# Altium project fastic_readout.PrjPcb (part 1 of 3)
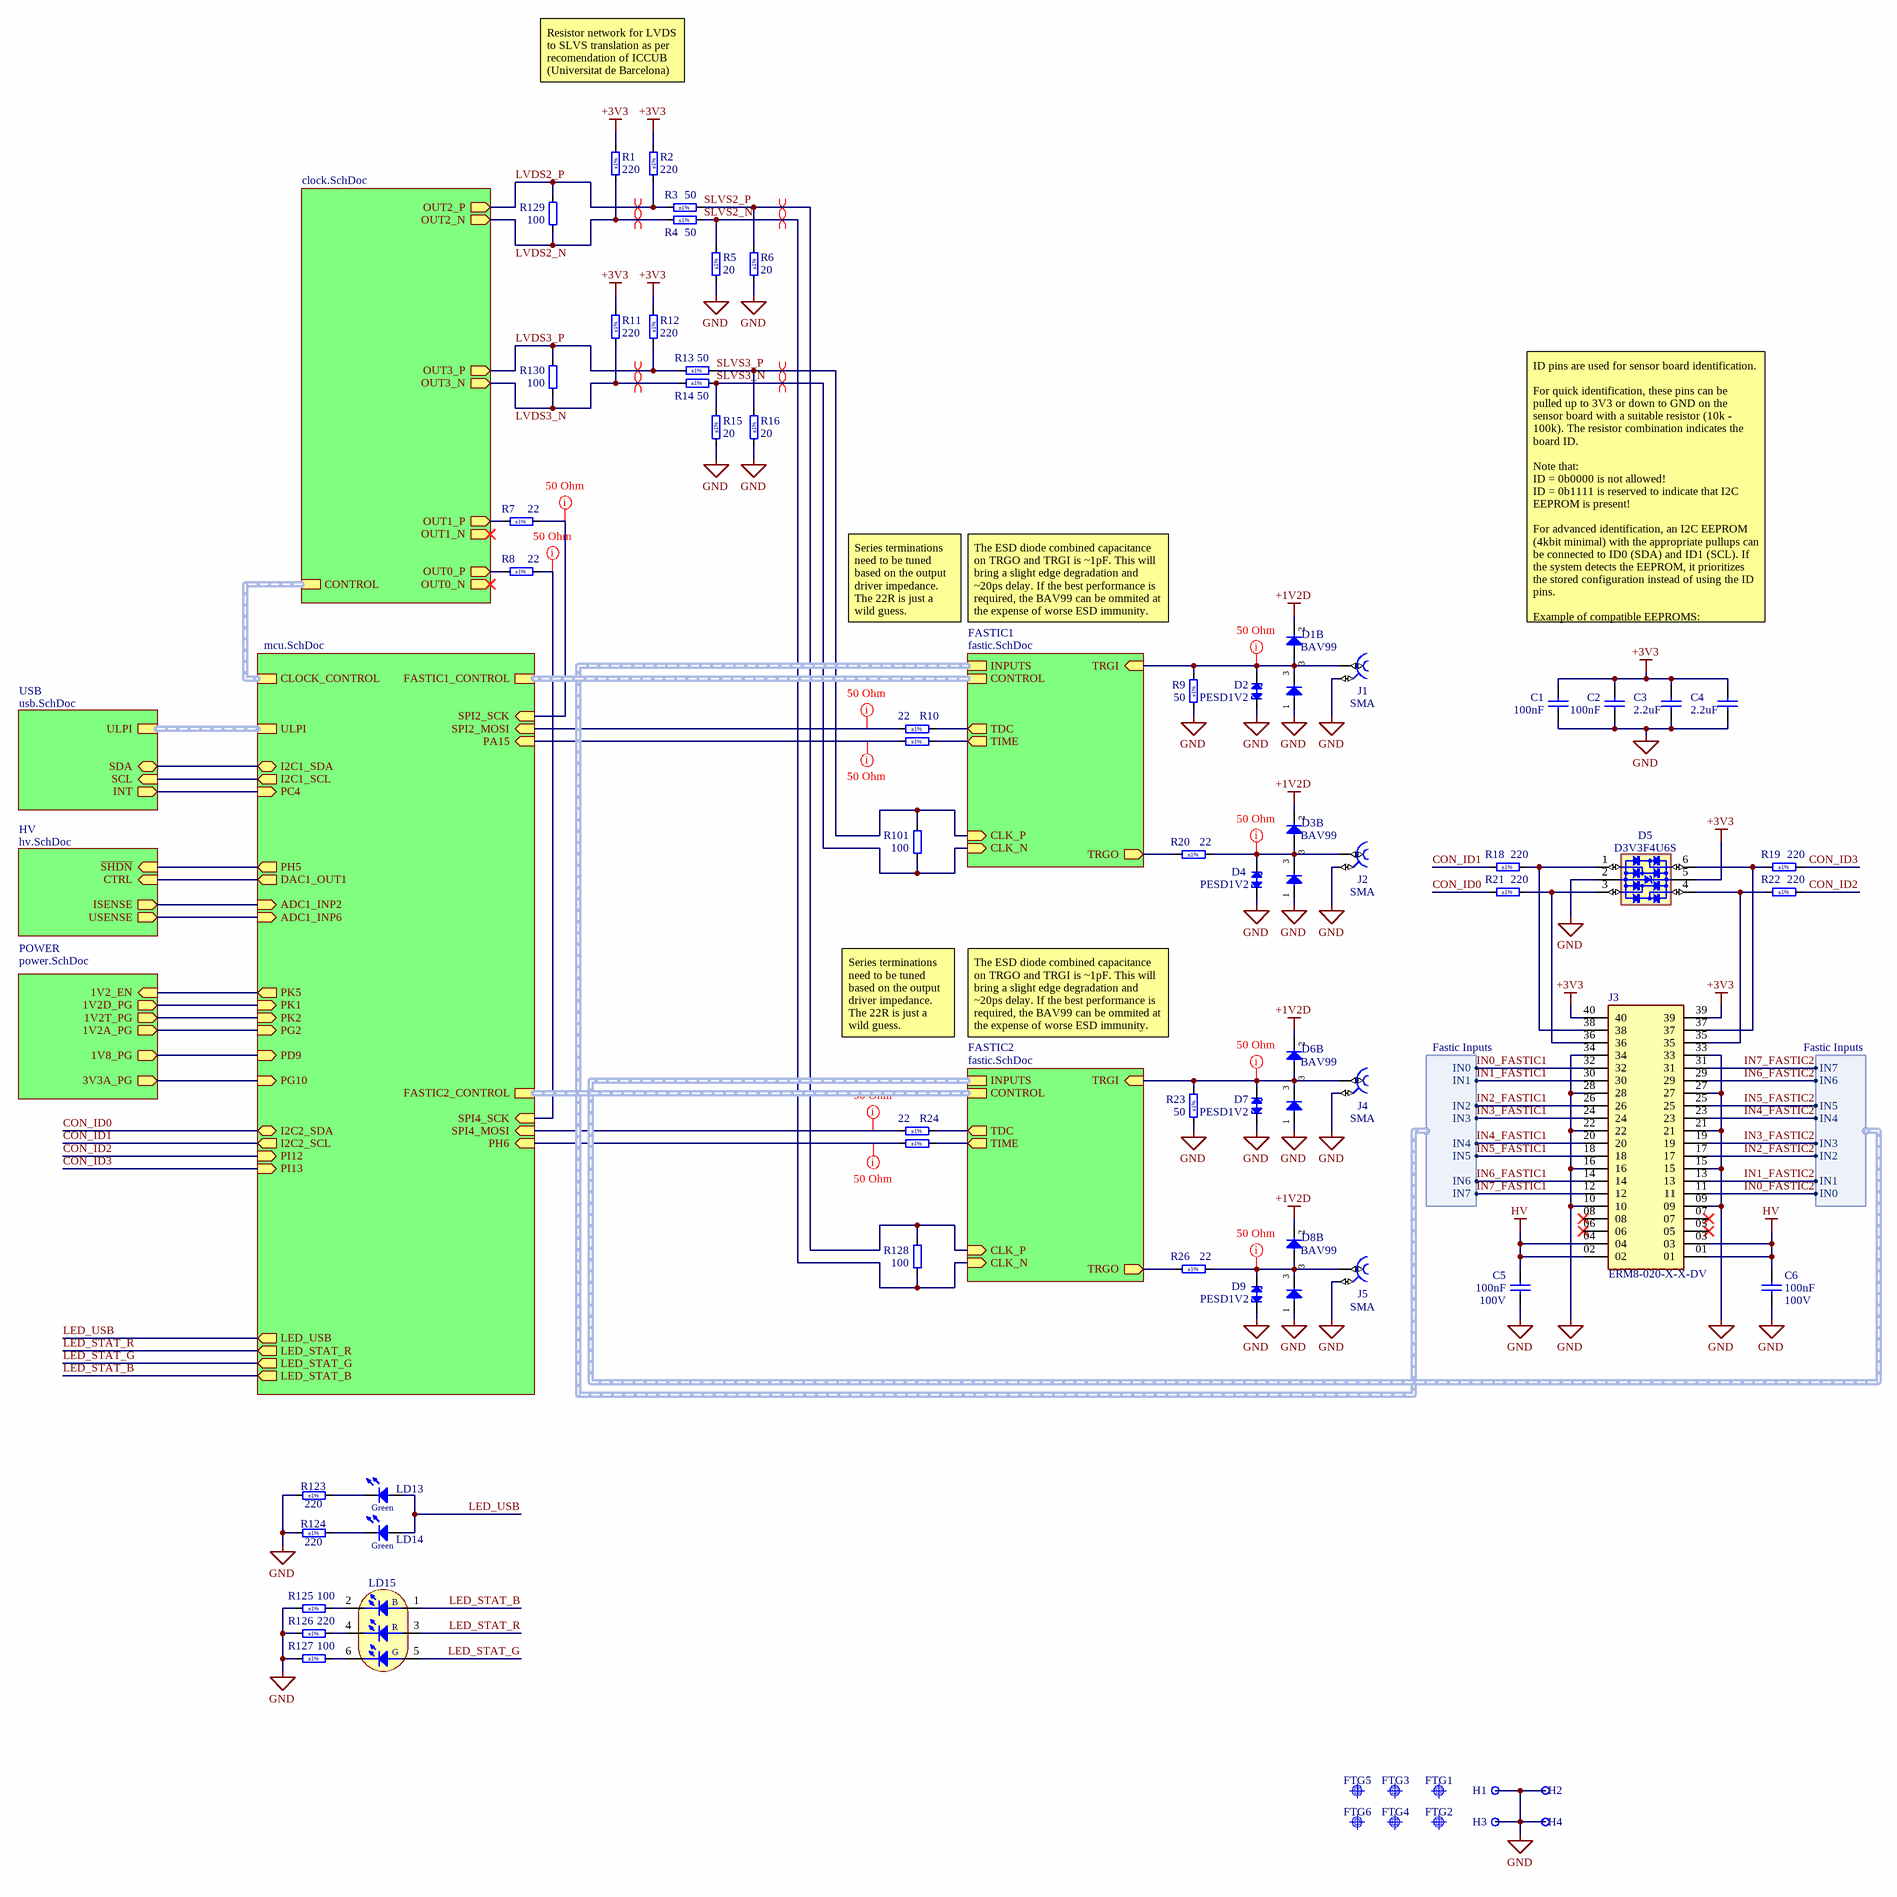
[diagram p0: top.SchDoc]
CheckedBy: Jerome A. Alozy; Designer: Vojtech Vosahlo; DivGrp: EP- ESE; DrawnBy: Vojtech Vosahlo; Projet: FastIC+ readout; revision: 1.0
7 sheets, 356 parts. Net scope: hierarchical (ports join the sheet entries above them; power ports are global).
Board file: fastic_readout.PcbDoc
Sheets:
  top.SchDoc
    FASTIC1 = fastic.SchDoc
    HV = hv.SchDoc
     = clock.SchDoc
    POWER = power.SchDoc
     = mcu.SchDoc
    USB = usb.SchDoc
    FASTIC2 = fastic.SchDoc

## Sheet top.SchDoc: FastIC+ readout
size 594 x 420 mm; CheckedBy: Jerome A. Alozy; CompanyName: CERN; DrawnBy: Vojtech Vosahlo; Organization: CERN; Address1: European Organization for Nuclear Research; Address2: CH-1211 Genève 23 - Switzerland; Revision: 2.0; SheetNumber: 1; SheetTotal: 7; Projet: Fast Timing; CreateDate: 11/1/2024; DivGrp: EP-ESE; Designer: Vojtech Vosahlo; ModifiedDate: -

### Parts
(Parts that share a designator on the sheet are numbered #1, #2 ... from top to bottom, then left to right.)
C1  100nF  [CAPC1005X55N]
C2  100nF  [CAPC1005X55N]
C3  2.2uF  [CAPC1608X90N]
C4  2.2uF  [CAPC1608X90N]
C5  100nF  Voltage: 100V  [CAPC1608X90N]
C6  100nF  Voltage: 100V  [CAPC1608X90N]
D1  BAV99  [SOT95P240X110-3N]  (value not drawn)  (parts A,B of 2)
D2  PESD1V2  [SOD962-2]
D3  BAV99  [SOT95P240X110-3N]  (value not drawn)  (parts A,B of 2)
D4  PESD1V2  [SOD962-2]
D5  D3V3F4U6S  [SOT65P220X110-6N]
D6  BAV99  [SOT95P240X110-3N]  (value not drawn)  (parts A,B of 2)
D7  PESD1V2  [SOD962-2]
D8  BAV99  [SOT95P240X110-3N]  (value not drawn)  (parts A,B of 2)
D9  PESD1V2  [SOD962-2]
FTG1  Use only in PCB  [FIDUCIAL_TOP_C100-200]  (value not drawn)
FTG2  Use only in PCB  [FIDUCIAL_TOP_C100-200]  (value not drawn)
FTG3  Use only in PCB  [FIDUCIAL_TOP_C100-200]  (value not drawn)
FTG4  Use only in PCB  [FIDUCIAL_TOP_C100-200]  (value not drawn)
FTG5  Use only in PCB  [FIDUCIAL_TOP_C100-200]  (value not drawn)
FTG6  Use only in PCB  [FIDUCIAL_TOP_C100-200]  (value not drawn)
H1  Plated Hole  [MTG240_400]  (value not drawn)  (no BOM)
H2  Plated Hole  [MTG240_400]  (value not drawn)  (no BOM)
H3  Plated Hole  [MTG240_400]  (value not drawn)  (no BOM)
H4  Plated Hole  [MTG240_400]  (value not drawn)  (no BOM)
J1  SMA  [AMPHENOL_132203]
J2  SMA  [AMPHENOL_132203]
J3  ERM8-020-X-X-DV  [SAMTEC_ERM8-020-X-X-DV]
J4  SMA  [AMPHENOL_132203]
J5  SMA  [AMPHENOL_132203]
LD13  Green  [LED_KINGBRIGHT_KPH-1608CGCK]
LD14  Green  [LED_KINGBRIGHT_KPH-1608CGCK]
LD15  Red/Green/Blue  [LED_EVERLIGHT_EAST1616RGBA8]  (value not drawn)
R1  220  Tolerance: ±1%  [RESC1005X40N]
R2  220  Tolerance: ±1%  [RESC1005X40N]
R3  50  Tolerance: ±1%  [RESC1005X40N]
R4  50  Tolerance: ±1%  [RESC1005X40N]
R5#1  20  Tolerance: ±1%  [RESC1005X40N]
R6  20  Tolerance: ±1%  [RESC1005X40N]
R7  22  Tolerance: ±1%  [RESC1005X40N]
R8  22  Tolerance: ±1%  [RESC1005X40N]
R9#1  50  Tolerance: ±1%  [RESC1005X40N]
R10  22  Tolerance: ±1%  [RESC1005X40N]
R11  220  Tolerance: ±1%  [RESC1005X40N]
R12  220  Tolerance: ±1%  [RESC1005X40N]
R13  50  Tolerance: ±1%  [RESC1005X40N]
R14  50  Tolerance: ±1%  [RESC1005X40N]
R15  20  Tolerance: ±1%  [RESC1005X40N]
R16  20  Tolerance: ±1%  [RESC1005X40N]
R17  Tolerance: ±1%  [RESC1005X40N]  (hidden comment: 22)
R18  220  Tolerance: ±1%  [RESC1005X40N]
R19  220  Tolerance: ±1%  [RESC1005X40N]
R20  22  Tolerance: ±1%  [RESC1005X40N]
R21  220  Tolerance: ±1%  [RESC1005X40N]
R22  220  Tolerance: ±1%  [RESC1005X40N]
R23  50  Tolerance: ±1%  [RESC1005X40N]
R24  22  Tolerance: ±1%  [RESC1005X40N]
R25  Tolerance: ±1%  [RESC1005X40N]  (hidden comment: 22)
R26  22  Tolerance: ±1%  [RESC1005X40N]
R101  100  [RESC1005X40N]
R123  220  Tolerance: ±1%  [RESC1005X40N]
R124  220  Tolerance: ±1%  [RESC1005X40N]
R125  100  Tolerance: ±1%  [RESC1005X40N]
R126  220  Tolerance: ±1%  [RESC1005X40N]
R127  100  Tolerance: ±1%  [RESC1005X40N]
R128  100  [RESC1005X40N]
R129  100  [RESC1005X40N]
R130  100  [RESC1005X40N]

### Sub-sheets
FASTIC1 = fastic.SchDoc: TRGI (in), TRGO (out), INPUTS (harness Fastic Inputs), CLK_P (in), CLK_N (in), TDC (out), TIME (out), CONTROL (harness Fastic Control)
FASTIC2 = fastic.SchDoc: TRGI (in), TRGO (out), INPUTS (harness Fastic Inputs), CLK_P (in), CLK_N (in), TDC (out), TIME (out), CONTROL (harness Fastic Control)
HV = hv.SchDoc: ISENSE (out), USENSE (out), ~{SHDN} (in), CTRL (in)
POWER = power.SchDoc: 1V8_PG (out), 3V3A_PG (out), 1V2A_PG (out), 1V2T_PG (out), 1V2D_PG (out), 1V2_EN (in)
USB = usb.SchDoc: ULPI (harness ULPI), SCL (in), SDA (bidir), INT (out)
? = clock.SchDoc: OUT0_P (out), OUT0_N (out), OUT1_P (out), OUT1_N (out), OUT2_P (out), OUT2_N (out), OUT3_P (out), OUT3_N (out), CONTROL (harness Clock Control)
? = mcu.SchDoc: ULPI (harness ULPI), CLOCK_CONTROL (harness Clock Control), FASTIC1_CONTROL (harness Fastic Control), FASTIC2_CONTROL (harness Fastic Control), DAC1_OUT1 (out), ADC1_INP2 (in), ADC1_INP6 (in), I2C2_SDA (bidir), I2C2_SCL (out), SPI2_MOSI (in), SPI4_SCK (in), SPI2_SCK (in), PH6 (in), PA15 (in), I2C1_SDA (bidir), I2C1_SCL (out), PI12 (in), PI13 (in), LED_USB (out), LED_STAT_R (out), LED_STAT_G (out), LED_STAT_B (out), SPI4_MOSI (in), PH5 (out), PK1 (in), PK2 (in), PG2 (in), PD9 (in), PG10 (in), PK5 (out), PC4 (in)

### Harnesses
Fastic Inputs: IN0, IN1, IN2, IN3, IN4, IN5, IN6, IN7

### Nets
+1V2D: D1.2(C) D3.2(C) D6.2(C) D8.2(C)
+3V3: C1.2 C2.2 C3.1 C4.1 D5.5(VBUS) J3.39 J3.40 R1.2 R2.2 R11.2 R12.2
GND: C1.1 C2.1 C3.2 C4.2 C5.1 C6.1 D1.1(A) D2.1(C) D3.1(A) D4.1(C) D5.2(GND) D6.1(A) D7.1(C) D8.1(A) D9.1(C) H1.1 H2.1 H3.1 H4.1 J1.2 J2.2 J3.09 J3.10 J3.15 J3.16 J3.21 J3.22 J3.27 J3.28 J3.33 J3.34 J4.2 J5.2 R5#1.1 R6.1 R9#1.1 R15.1 R16.1 R23.1 R123.1 R124.1 R125.1 R126.1 R127.1
HV: C5.2 C6.2 J3.01 J3.02 J3.03 J3.04
CON_ID0: R21.1 ; sheet /I2C2_SDA
CON_ID1: R18.1 ; sheet /I2C2_SCL
CON_ID2: R22.2 ; sheet /PI12
CON_ID3: R19.2 ; sheet /PI13
IN0_FASTIC1: J3.32 ; sheet FASTIC1/INPUTS.IN0  [project net IN0]
IN0_FASTIC2: J3.11 ; sheet FASTIC2/INPUTS.IN0  [project net IN0]
IN1_FASTIC1: J3.30 ; sheet FASTIC1/INPUTS.IN1  [project net IN1]
IN1_FASTIC2: J3.13 ; sheet FASTIC2/INPUTS.IN1  [project net IN1]
IN2_FASTIC1: J3.26 ; sheet FASTIC1/INPUTS.IN2  [project net IN2]
IN2_FASTIC2: J3.17 ; sheet FASTIC2/INPUTS.IN2  [project net IN2]
IN3_FASTIC1: J3.24 ; sheet FASTIC1/INPUTS.IN3  [project net IN3]
IN3_FASTIC2: J3.19 ; sheet FASTIC2/INPUTS.IN3  [project net IN3]
IN4_FASTIC1: J3.20 ; sheet FASTIC1/INPUTS.IN4  [project net IN4]
IN4_FASTIC2: J3.23 ; sheet FASTIC2/INPUTS.IN4  [project net IN4]
IN5_FASTIC1: J3.18 ; sheet FASTIC1/INPUTS.IN5  [project net IN5]
IN5_FASTIC2: J3.25 ; sheet FASTIC2/INPUTS.IN5  [project net IN5]
IN6_FASTIC1: J3.14 ; sheet FASTIC1/INPUTS.IN6  [project net IN6]
IN6_FASTIC2: J3.29 ; sheet FASTIC2/INPUTS.IN6  [project net IN6]
IN7_FASTIC1: J3.12 ; sheet FASTIC1/INPUTS.IN7  [project net IN7]
IN7_FASTIC2: J3.31 ; sheet FASTIC2/INPUTS.IN7  [project net IN7]
LED_STAT_B: LD15.1(AB) ; sheet /LED_STAT_B
LED_STAT_G: LD15.5(AG) ; sheet /LED_STAT_G
LED_STAT_R: LD15.3(AR) ; sheet /LED_STAT_R
LED_USB: LD13.2(A) LD14.2(A) ; sheet /LED_USB
LVDS2_N: R1.1 R4.1 R129.2 ; sheet /OUT2_N
LVDS2_P: R2.1 R3.1 R129.1 ; sheet /OUT2_P
LVDS3_N: R11.1 R14.1 R130.2 ; sheet /OUT3_N
LVDS3_P: R12.1 R13.1 R130.1 ; sheet /OUT3_P
SLVS2_N: R4.2 R5#1.2 R128.2 ; sheet FASTIC2/CLK_N
SLVS2_P: R3.2 R6.2 R128.1 ; sheet FASTIC2/CLK_P
SLVS3_N: R14.2 R15.2 R101.2 ; sheet FASTIC1/CLK_N
SLVS3_P: R13.2 R16.2 R101.1 ; sheet FASTIC1/CLK_P
NetD1_3: D1.3(COMAC) D2.2(C) J1.1 R9#1.2 ; sheet FASTIC1/TRGI
NetD3_3: D3.3(COMAC) D4.2(C) J2.1 R20.2
NetD5_1: D5.1(I/O1) J3.38 R18.2
NetD5_3: D5.3(I/O2) J3.36 R21.2
NetD5_4: D5.4(I/O3) J3.35 R22.1
NetD5_6: D5.6(I/O4) J3.37 R19.1
NetD6_3: D6.3(COMAC) D7.2(C) J4.1 R23.2 ; sheet FASTIC2/TRGI
NetD8_3: D8.3(COMAC) D9.2(C) J5.1 R26.2
NetIC1_FASTIC1_6: R17.1 ; sheet FASTIC1/TIME
NetIC1_FASTIC1_7: R10.1 ; sheet FASTIC1/TDC
NetIC1_FASTIC2_6: R25.1 ; sheet FASTIC2/TIME
NetIC1_FASTIC2_7: R24.1 ; sheet FASTIC2/TDC
NetIC4_5: sheet POWER/1V8_PG, sheet /PD9
NetIC5_5: sheet POWER/3V3A_PG, sheet /PG10
NetIC6_4: sheet POWER/1V2_EN, sheet /PK5
NetIC6_5: sheet POWER/1V2D_PG, sheet /PK1
NetIC7_5: sheet POWER/1V2T_PG, sheet /PK2
NetIC8_5: sheet POWER/1V2A_PG, sheet /PG2
NetIC14_5: sheet /PC4, sheet USB/INT
NetIC14_6: sheet /I2C1_SCL, sheet USB/SCL
NetIC14_7: sheet /I2C1_SDA, sheet USB/SDA
NetIC18_FASTIC1_35: R20.1 ; sheet FASTIC1/TRGO
NetIC18_FASTIC2_35: R26.1 ; sheet FASTIC2/TRGO
NetIC29_1: sheet HV/ISENSE, sheet /ADC1_INP2
NetIC30_1: sheet HV/USENSE, sheet /ADC1_INP6
NetLD13_1: LD13.1(C) R123.2
NetLD14_1: LD14.1(C) R124.2
NetLD15_2: LD15.2(CB) R125.2
NetLD15_4: LD15.4(CR) R126.2
NetLD15_6: LD15.6(CG) R127.2
NetR7_1: R7.1 ; sheet /OUT1_P
NetR7_2: R7.2 ; sheet /SPI2_SCK
NetR8_1: R8.1 ; sheet /OUT0_P
NetR8_2: R8.2 ; sheet /SPI4_SCK
NetR10_2: R10.2 ; sheet /SPI2_MOSI
NetR17_2: R17.2 ; sheet /PA15
NetR24_2: R24.2 ; sheet /SPI4_MOSI
NetR25_2: R25.2 ; sheet /PH6
NetU1_28: sheet HV/CTRL, sheet /DAC1_OUT1
(unnamed): sheet HV/~{SHDN}, sheet /PH5

Not connected (* = marked no-connect by the designer): J3 05* 06* 07* 08*

### Buses and harness runs
harness sheet /CLOCK_CONTROL = sheet /CONTROL
harness sheet /FASTIC1_CONTROL = sheet FASTIC1/CONTROL
harness sheet /FASTIC2_CONTROL = sheet FASTIC2/CONTROL
harness sheet /ULPI = sheet USB/ULPI

### Layout directives
differential pair: LVDS2_N, LVDS2_P, LVDS3_N, LVDS3_P, SLVS2_N, SLVS2_P, SLVS3_N, SLVS3_P
net class 50Ohm: NetD1_3, NetD3_3, NetD6_3, NetD8_3, NetR7_2, NetR8_2, NetR10_2, NetR17_2, NetR24_2, NetR25_2

### Notes on the sheet
- Resistor network for LVDS to SLVS translation as per recomendation of ICCUB (Universitat de Barcelona)
- Series terminations need to be tuned based on the output driver impedance. The 22R is just a wild guess.
- The ESD diode combined capacitance on TRGO and TRGI is ~1pF. This will bring a slight edge degradation and ~20ps delay. If the best performance is required, the BAV99 can be ommited at the expense of worse ESD immunity.
- ID pins are used for sensor board identification.
  For quick identification, these pins can be pulled up to 3V3 or down to GND on the sensor board with a suitable resistor (10k - 100k). The resistor combination indicates the board ID.
  Note that:
  ID = 0b0000 is not allowed!
  ID = 0b1111 is reserved to indicate that I2C EEPROM is present!
  For advanced identification, an I2C EEPROM (4kbit minimal) with the appropriate pullups can be connected to ID0 (SDA) and ID1 (SCL). If the system detects the EEPROM, it prioritizes the stored configuration instead of using the ID pins.
  Example of compatible EEPROMS:
  • Microchip 24AA series (eg. 24AA04T-I/OT)
- Project/Equipment
- Document
- File
- Designer
- Drawn by
- Check.by
- Last Mod.
- Print Date
- Sheet
- Size
- A2
- of
- Rev
- (in symbol LED_EVERLIGHT_EAST1616RGBA8) B; R; G

### Library data of the parts
C1 C2 = CC0402_100NF_16V_10%_X7R: Non-polarised capacitor; Part Description: SMD Multilayer Chip Ceramic Capacitor; Manufacturer: GENERIC; Manufacturer1 Part Number: GRM155R71C104KA88D; Voltage: 16V; TC: X7R; Tolerance: ±10%; Part Number: CC0402_100NF_16V_10%_X7R; Component Kind: Standard; Component Type: Standard; Pin Count: 2; Value: 100nF; Status: Not Recommended; Manufacturer Part Number: CC0402_100NF_16V_10%_X7R; Case: 0402; Mounted: Yes; Socket: No; SMD: Yes; Sense: No; Manufacturer1 Example: MURATA; Manufacturer1 ComponentHeight: 0.55mm; HelpURL: \\cern.ch\dfs\Applications\Altium\Datasheets\CC0402_X7R_MURATA_GRM.pdf; Author: CERN DEM JLC; CreateDate: 12/5/2013; LatestRevisionDate: 12/3/2007
C3 C4 = CC0603_2.2UF_10V_20%_X7R: Non-polarised capacitor; Part Description: SMD Multilayer Chip Ceramic Capacitor; Manufacturer: GENERIC; Manufacturer1 Part Number: LMK107B7225MA-T; Voltage: 10V; TC: X7R; Tolerance: ±20%; Part Number: CC0603_2.2UF_10V_20%_X7R; Component Kind: Standard; Component Type: Standard; Pin Count: 2; Value: 2.2uF; Status: Not Recommended; Manufacturer Part Number: CC0603_2.2UF_10V_20%_X7R; Case: 0603; Mounted: Yes; Socket: No; SMD: Yes; Sense: No; Manufacturer1 Example: TAIYO YUDEN; Manufacturer1 ComponentHeight: 0.9mm; HelpURL: \\cern.ch\dfs\Applications\Altium\Datasheets\CC0603_X7R_TAIYO-YUDEN_HIGH-VALUE.pdf; Author: CERN DEM JLC; CreateDate: 6/22/2011; LatestRevisionDate: 6/27/2011
C5 C6 = CC0603_100NF_100V_10%_X7R: Non-polarised capacitor; Part Description: SMD Multilayer Chip Ceramic Capacitor; Manufacturer: GENERIC; Manufacturer1 Part Number: GRM188R72A104KA35D; TC: X7R; Tolerance: ±10%; Part Number: CC0603_100NF_100V_10%_X7R; Component Kind: Standard; Component Type: Standard; Pin Count: 2; Value: 100nF; Status: None; Manufacturer Part Number: CC0603_100NF_100V_10%_X7R; Case: 0603; Mounted: Yes; Socket: No; SMD: Yes; Sense: No; Manufacturer1 Example: MURATA; Manufacturer1 ComponentHeight: 0.9mm; HelpURL: \\cern.ch\dfs\Applications\Altium\Datasheets\CC0603_MURATA_GRM188R72A104KA35D.pdf; Author: CERN DEM JLC; CreateDate: 12/11/2013; LatestRevisionDate: 12/11/2013
D1 D3 D6 D8 = BAV99: Serial Diode; Part Description: Dual Series Signal Diode; Manufacturer: FAIRCHILD SEMICONDUCTOR; Voltage: 70V; Power: 350mW; PressFit: No; Bonding: No; Part Number: BAV99; Component Kind: Standard; Component Type: Standard; Device: BAV99; PackageDescription: SOT, 0.95mm Pitch; 3 Pin, 1.40mm W X 3.00mm L X 1.10mm H body, IPC Medium Density; Manufacturer Part Number: BAV99; Pin Count: 3; Case: SOT23-3; Mounted: Yes; Socket: No; SMD: Yes; Sense: No; ComponentHeight: 1.1mm; HelpURL: \\cern.ch\dfs\Applications\Altium\Datasheets\BAV99.pdf; Author: CERN DEM JLC; CreateDate: 5/6/2008; LatestRevisionDate: 9/27/2012
D2 D4 D7 D9 = PESD1V2Y1BSF
D5 = D3V3F4U6S: Integrated Quad Ultra-Low Capacitance ESD Protection; Part Description: 0.85pF 4 Channel Low Capacitance TVS Diode Array ESD; Manufacturer: DIODES INCORPORATED; PressFit: No; Bonding: No; Voltage: 8kV; Part Number: D3V3F4U6S; Component Kind: Standard; Component Type: Standard; Device: D3V3F4U6S; PackageDescription: SOT363, SC70-6, 0.65mm Pitch; 6 pin, 1.25mm W X 2.00mm L X 1.10mm H body, IPC Medium Density; Manufacturer Part Number: D3V3F4U6S; Pin Count: 6; Case: SOT363; Mounted: Yes; Socket: No; SMD: Yes; Sense: No; ComponentHeight: 2.1mm; HelpURL: \\cern.ch\dfs\Applications\Altium\Datasheets\D3V3F4U6S.pdf; Author: CERN DEM HF; CreateDate: 11/28/2022; LatestRevisionDate: 11/28/2022
FTG1-FTG6 = FIDUCIAL_TARGET_C100-200: Fiducial Target; Part Description: Round Fiducial Target, Top Layer, 1.0mm, Top Solder 2.0mm, Keepout =2.0mm; Mounted: No; Part Number: FIDUCIAL_TARGET_C100-200; Component Kind: Standard (No BOM); Component Type: Standard (No BOM); Pin Count: 1; Family: Fiducial; Socket: No; SMD: Yes; Sense: No; Status: None; ComponentHeight: 0mm; HelpURL: Undefined; Author: CERN DEM JLC; CreateDate: 2/9/2010; LatestRevisionDate: 4/4/2012; PackageDescription: Round Fiducial Target, Top Layer, 1.0mm, Top Solder 2.0mm, Keepout =2.0mm
H1-H4 = PLATED_HOLE2.4_PAD4.0: Single Terminal Socket; Part Description: Plated Through Hole: Hole Dia.=2.4mm Pad Dia.=4.0mm; Mounted: No; Part Number: PLATED_HOLE2.4_PAD4.0; Component Type: Standard (No BOM); Pin Count: 1; Family: Plated Hole; Socket: No; SMD: No; Sense: No; Status: None; ComponentHeight: 0mm; HelpURL: Undefined; Author: CERN DEM JMW; CreateDate: 10/10/2011; LatestRevisionDate: 10/10/2011; PackageDescription: Plated Through Hole: Hole Dia.=2.4mm Pad Dia.=4.0mm
J1 J2 J4 J5 = AMPHENOL_132203: Part Description: 50 Ohms SMA Through Hole Right Angle PCB Jack; Manufacturer Part Number: 132203; PressFit: No; Part Number: AMPHENOL_132203; Component Kind: Standard; Component Type: Standard; Pin Count: 5; Family: SMA; Mounted: Yes; Socket: No; SMD: No; Sense: No; Status: None; Manufacturer: AMPHENOL; ComponentHeight: 10.44mm; HelpURL: \\cern.ch\dfs\Applications\Altium\Datasheets\AMPHENOL_132203.pdf; Author: CERN DEM MR; CreateDate: 10/6/2016; LatestRevisionDate: 10/6/2016
J3 = ERM8-020-X-X-DV: MF: {'manufacturer': u'Samtec Inc.'}; Package: None; Price: None; Value: *; MP: ERM8-020-X-X-DV; Availability: Unavailable
LD13 LD14 = LED_KINGBRIGHT_KPH-1608CGCK: LED Green 1C 2A; Part Description: SMD Green LED, Case 1.6mmX0.8mm(0603), 0.65mm Thickness; PressFit: No; Bonding: No; Part Number: LED_KINGBRIGHT_KPH-1608CGCK; Component Kind: Standard; Component Type: Standard; Color: Green; PackageDescription: SMT Green LED, Case 0603, Body L 1.6 x W 0.8mm H 0.65mm; Manufacturer: KINGBRIGHT; Manufacturer Part Number: KPH-1608CGCK; Pin Count: 2; Case: 0603; Mounted: Yes; Socket: No; SMD: Yes; Sense: No; ComponentHeight: 0.65mm; HelpURL: \\cern.ch\dfs\Applications\Altium\Datasheets\LED_KINGBRIGHT_KPH-1608CGCK.pdf; Author: CERN DEM JLC; CreateDate: 7/3/2017; LatestRevisionDate: 7/3/2017
LD15 = LED_EVERLIGHT_EAST1616RGBA8: Everlight Tricolor (Red/Green/Blue) Surface Mount LED; PressFit: No; Bonding: No; Part Number: LED_EVERLIGHT_EAST1616RGBA8; Component Kind: Standard; Component Type: Standard; Color: Red/Green/Blue; PackageDescription: Tricolor (RGB) Surface Mount LED, Body 1.6mm X 1.6mm X 0.35mm; Part Description: Everlight Tricolor (Red/Green/Blue) Surface Mount LED; Manufacturer: EVERLIGHT; Manufacturer Part Number: EAST1616RGBA8; Pin Count: 6; Mounted: Yes; Socket: No; SMD: Yes; Sense: No; ComponentHeight: 0.35mm; HelpURL: \\cern.ch\dfs\Applications\Altium\Datasheets\LED_EVERLIGHT_EAST1616RGBA8.pdf; Author: CERN DEM HF; CreateDate: 4/11/2022; LatestRevisionDate: 4/11/2022
R1 R2 R11 R12 R18 R19 R21 R22 R123 R124 R126 = R0402_220R_1%_0.0625W_100PPM: Resistor - 1%; Part Description: General Purpose Thick Film Chip Resistor; Manufacturer: GENERIC; Manufacturer1 Part Number: 232270672201L; TC: ±100ppm/°C; PressFit: No; Part Number: R0402_220R_1%_0.0625W_100PPM; Component Kind: Standard; Component Type: Standard; Pin Count: 2; Value: 220; Status: Not Recommended; Power: 0.0625W; Manufacturer Part Number: R0402_220R_1%_0.0625W_100PPM; Case: 0402; Mounted: Yes; Sense: No; Socket: No; SMD: Yes; Manufacturer1 Example: YAGEO PHYCOMP; Manufacturer1 ComponentHeight: 0.4mm; HelpURL: \\cern.ch\dfs\Applications\Altium\Datasheets\R0402_Phycomp_RC0402.pdf; Author: CERN DEM JLC; CreateDate: 12/3/2007; LatestRevisionDate: 10/17/2012
R3 R4 R9#1 R13 R14 R23 = R0402_50R_1%_0.063W_50PPM_KOA_RN73R: Resistor - 1%; Part Description: Precision Thin (Metal) Film Flat Chip Resistor; Manufacturer: KOA; Manufacturer Part Number: RN73R1ETTP50R0F50; Power: 0.063W; TC: ±50ppm/°C; PressFit: No; Part Number: R0402_50R_1%_0.063W_50PPM_KOA_RN73R; Component Kind: Standard; Component Type: Standard; Pin Count: 2; Value: 50; Status: Not Recommended; Case: 0402; Mounted: Yes; Sense: No; Socket: No; SMD: Yes; ComponentHeight: 0.4mm; HelpURL: \\cern.ch\dfs\Applications\Altium\Datasheets\R0402_KOA_RN73R.pdf; Author: CERN DEM BC; CreateDate: 11/11/2020; LatestRevisionDate: 11/11/2020
R5#1 R6 R15 R16 = R0402_20R_1%_0.0625W_100PPM: Resistor - 1%; Part Description: General Purpose Thick Film Chip Resistor; Manufacturer: GENERIC; Manufacturer1 Part Number: 232270672009L; TC: ±100ppm/°C; PressFit: No; Part Number: R0402_20R_1%_0.0625W_100PPM; Component Kind: Standard; Component Type: Standard; Pin Count: 2; Value: 20; Status: Not Recommended; Power: 0.0625W; Manufacturer Part Number: R0402_20R_1%_0.0625W_100PPM; Case: 0402; Mounted: Yes; Sense: No; Socket: No; SMD: Yes; Manufacturer1 Example: YAGEO PHYCOMP; Manufacturer1 ComponentHeight: 0.4mm; HelpURL: \\cern.ch\dfs\Applications\Altium\Datasheets\R0402_Phycomp_RC0402.pdf; Author: CERN DEM JLC; CreateDate: 12/3/2007; LatestRevisionDate: 10/17/2012
R7 R8 R10 R17 R20 R24-R26 = R0402_22R_1%_0.0625W_100PPM: Resistor - 1%; Part Description: General Purpose Thick Film Chip Resistor; Manufacturer: GENERIC; Manufacturer1 Part Number: 232270672209L; TC: ±100ppm/°C; PressFit: No; Part Number: R0402_22R_1%_0.0625W_100PPM; Component Kind: Standard; Component Type: Standard; Pin Count: 2; Value: 22; Status: Not Recommended; Power: 0.0625W; Manufacturer Part Number: R0402_22R_1%_0.0625W_100PPM; Case: 0402; Mounted: Yes; Sense: No; Socket: No; SMD: Yes; Manufacturer1 Example: YAGEO PHYCOMP; Manufacturer1 ComponentHeight: 0.4mm; HelpURL: \\cern.ch\dfs\Applications\Altium\Datasheets\R0402_Phycomp_RC0402.pdf; Author: CERN DEM JLC; CreateDate: 12/3/2007; LatestRevisionDate: 10/17/2012
R101 R128-R130 = R0402_100R_1%_0.1W_100PPM: Resistor - 1%; Part Description: General Purpose Thick Film Chip Resistor; Manufacturer: GENERIC; Manufacturer Part Number: R0402_100R_1%_0.1W_100PPM_50V; Manufacturer1 Part Number: ERJ2RKF1000X; Power: 0.1W; TC: ±100ppm/°C; PressFit: No; Voltage: 50V; Part Number: R0402_100R_1%_0.1W_100PPM; Component Kind: Standard; Component Type: Standard; Pin Count: 2; Value: 100; Status: Not Recommended; Tolerance: ±1%; Case: 0402; Mounted: Yes; Sense: No; Socket: No; SMD: Yes; Manufacturer1 Example: PANASONIC; Manufacturer1 ComponentHeight: 0.4mm; HelpURL: \\cern.ch\dfs\Applications\Altium\Datasheets\R0402_PANASONIC_ERJ2RK.pdf; Author: CERN DEM JLC; CreateDate: 12/12/2013; LatestRevisionDate: 3/3/2015
R125 R127 = R0402_100R_1%_0.1W_100PPM: Resistor - 1%; Part Description: General Purpose Thick Film Chip Resistor; Manufacturer: GENERIC; Manufacturer Part Number: R0402_100R_1%_0.1W_100PPM_50V; Manufacturer1 Part Number: ERJ2RKF1000X; Power: 0.1W; TC: ±100ppm/°C; Voltage: 50V; PressFit: No; Part Number: R0402_100R_1%_0.1W_100PPM; Component Kind: Standard; Component Type: Standard; Pin Count: 2; Value: 100; Status: Not Recommended; Case: 0402; Mounted: Yes; Sense: No; Socket: No; SMD: Yes; Manufacturer1 Example: PANASONIC; Manufacturer1 ComponentHeight: 0.4mm; HelpURL: \\cern.ch\dfs\Applications\Altium\Datasheets\R0402_PANASONIC_ERJ2RK.pdf; Author: CERN DEM JLC; CreateDate: 12/12/2013; LatestRevisionDate: 3/3/2015

## Sheet fastic.SchDoc: FastIC+ readout
size 594 x 420 mm; CheckedBy: Jerome A. Alozy; CompanyName: CERN; DrawnBy: Vojtech Vosahlo; Organization: CERN; Address1: European Organization for Nuclear Research; Address2: CH-1211 Genève 23 - Switzerland; Revision: 2.0; SheetNumber: 2; SheetTotal: 7; Projet: Fast Timing; ModifiedBy: -; CreateDate: 11/1/2024; CheckedDate: -; DivGrp: EP-ESE; Designer: Vojtech Vosahlo; ModifiedDate: -
Used 2 times, as channels FASTIC1, FASTIC2. Parts and nets are listed once, with the designators drawn on the sheet.
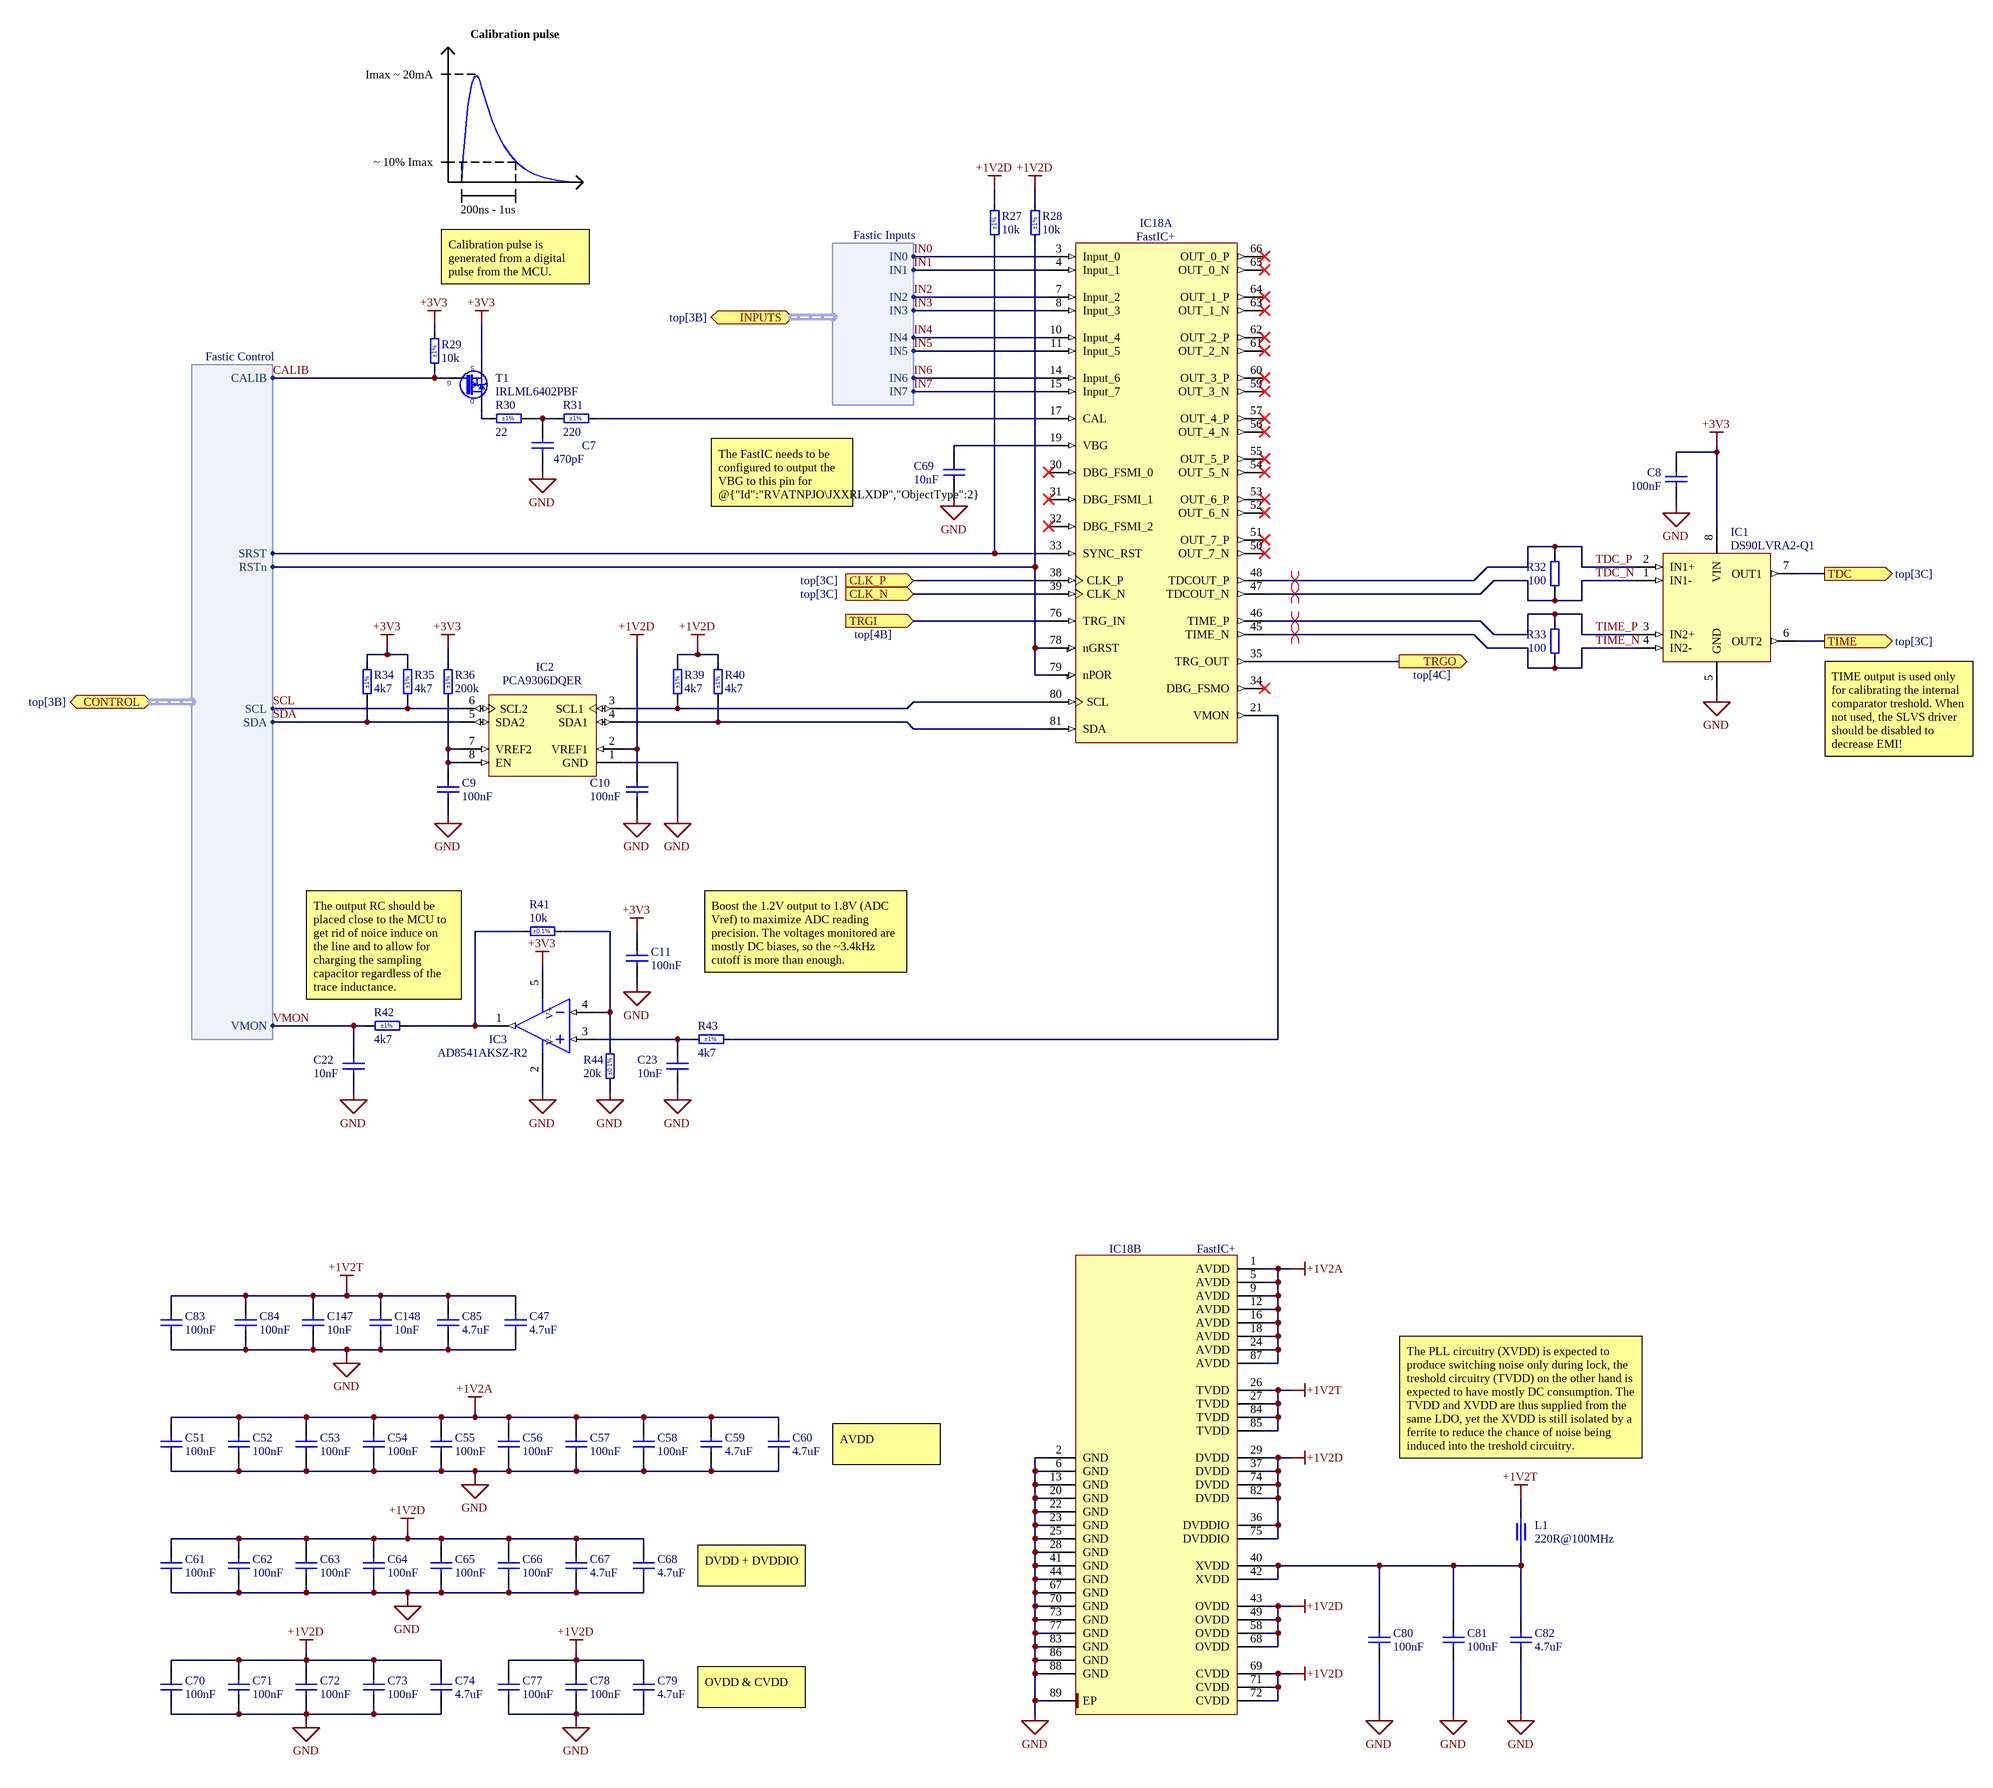
[diagram p1: fastic.SchDoc]

### Parts
C7  470pF  [CAPC1005X55N]
C8  100nF  [CAPC1005X55N]
C9  100nF  [CAPC1005X55N]
C10  100nF  [CAPC1005X55N]
C11  100nF  [CAPC1005X55N]
C22  10nF  [CAPC1005X55N]
C23  10nF  [CAPC1005X55N]
C47  4.7uF  [CAPC1608X87N]
C51  100nF  [CAPC1005X55N]
C52  100nF  [CAPC1005X55N]
C53  100nF  [CAPC1005X55N]
C54  100nF  [CAPC1005X55N]
C55  100nF  [CAPC1005X55N]
C56  100nF  [CAPC1005X55N]
C57  100nF  [CAPC1005X55N]
C58  100nF  [CAPC1005X55N]
C59  4.7uF  [CAPC1608X87N]
C60  4.7uF  [CAPC1608X87N]
C61  100nF  [CAPC1005X55N]
C62  100nF  [CAPC1005X55N]
C63  100nF  [CAPC1005X55N]
C64  100nF  [CAPC1005X55N]
C65  100nF  [CAPC1005X55N]
C66  100nF  [CAPC1005X55N]
C67  4.7uF  [CAPC1608X87N]
C68  4.7uF  [CAPC1608X87N]
C69  10nF  [CAPC1005X55N]
C70  100nF  [CAPC1005X55N]
C71  100nF  [CAPC1005X55N]
C72  100nF  [CAPC1005X55N]
C73  100nF  [CAPC1005X55N]
C74  4.7uF  [CAPC1608X87N]
C77  100nF  [CAPC1005X55N]
C78  100nF  [CAPC1005X55N]
C79  4.7uF  [CAPC1608X87N]
C80  100nF  [CAPC1005X55N]
C81  100nF  [CAPC1005X55N]
C82  4.7uF  [CAPC1608X87N]
C83  100nF  [CAPC1005X55N]
C84  100nF  [CAPC1005X55N]
C85  4.7uF  [CAPC1608X87N]
C147  10nF  [CAPC1005X55N]
C148  10nF  [CAPC1005X55N]
IC1  DS90LVRA2-Q1  [DS90LVRA2-Q1]
IC2  PCA9306DQER  [SON35P100X140X40-8N]
IC3  AD8541AKSZ-R2  [SOT65P210X110-5N]
IC18  FastIC+  [QFN40P1000X1000X85-89N-S760]  (parts A,B of 2)
L1  220R@100MHz  [INDC1005X55N]
R27  10k  Tolerance: ±1%  [RESC1005X40N]
R28  10k  Tolerance: ±1%  [RESC1005X40N]
R29  10k  Tolerance: ±1%  [RESC1005X40N]
R30  22  Tolerance: ±1%  [RESC1005X40N]
R31  220  Tolerance: ±1%  [RESC1005X40N]
R32  100  [RESC1005X40N]
R33  100  [RESC1005X40N]
R34  4k7  Tolerance: ±1%  [RESC1005X40N]
R35  4k7  Tolerance: ±1%  [RESC1005X40N]
R36  200k  Tolerance: ±1%  [RESC1005X40N]
R39  4k7  Tolerance: ±1%  [RESC1005X40N]
R40  4k7  Tolerance: ±1%  [RESC1005X40N]
R41  10k  Tolerance: ±0.1%  [RESC1005X35N]
R42  4k7  Tolerance: ±1%  [RESC1005X40N]
R43  4k7  Tolerance: ±1%  [RESC1005X40N]
R44  20k  Tolerance: ±0.1%  [RESC1005X40N]
T1  IRLML6402PBF  [SOT95P237X112-3N]

### Ports
CLK_N (in, see top[3C]), CLK_P (in, see top[3C]), CONTROL (bidir, harness Fastic Control, see top[3B]), INPUTS (bidir, harness Fastic Inputs, see top[3B]), TDC (out, see top[3C]), TIME (out, see top[3C]), TRGI (in, see top[4B]), TRGO (out, see top[4C])

### Harnesses
Fastic Inputs: IN0, IN1, IN2, IN3, IN4, IN5, IN6, IN7
Fastic Control: CALIB, SRST, RSTn, SDA, VMON, SCL

### Nets
+1V2A: C51.1 C52.1 C53.1 C54.1 C55.1 C56.1 C57.1 C58.1 C59.1 C60.1 IC18.1(AVDD) IC18.5(AVDD) IC18.9(AVDD) IC18.12(AVDD) IC18.16(AVDD) IC18.18(AVDD) IC18.24(AVDD) IC18.87(AVDD)
+1V2D: C10.1 C61.1 C62.1 C63.1 C64.1 C65.1 C66.1 C67.1 C68.1 C70.1 C71.1 C72.1 C73.1 C74.1 C77.1 C78.1 C79.1 IC2.2(VREF1) IC18.29(DVDD) IC18.36(DVDDIO) IC18.37(DVDD) IC18.43(OVDD) IC18.49(OVDD) IC18.58(OVDD) IC18.68(OVDD) IC18.69(CVDD) IC18.71(CVDD) IC18.72(CVDD) IC18.74(DVDD) IC18.75(DVDDIO) IC18.82(DVDD) R27.2 R28.2 R39.2 R40.2
+1V2T: C47.1 C83.1 C84.1 C85.1 C147.1 C148.1 IC18.26(TVDD) IC18.27(TVDD) IC18.84(TVDD) IC18.85(TVDD) L1.2
+3V3: C8.1 C11.2 IC1.8(VIN) IC3.5(V+) R29.2 R34.2 R35.2 R36.2 T1.2(S)
GND: C7.1 C8.2 C9.2 C10.2 C11.1 C22.1 C23.1 C47.2 C51.2 C52.2 C53.2 C54.2 C55.2 C56.2 C57.2 C58.2 C59.2 C60.2 C61.2 C62.2 C63.2 C64.2 C65.2 C66.2 C67.2 C68.2 C69.2 C70.2 C71.2 C72.2 C73.2 C74.2 C77.2 C78.2 C79.2 C80.2 C81.2 C82.2 C83.2 C84.2 C85.2 C147.2 C148.2 IC1.5(GND) IC2.1(GND) IC3.2(V-) IC18.2(GND) IC18.6(GND) IC18.13(GND) IC18.20(GND) IC18.22(GND) IC18.23(GND) IC18.25(GND) IC18.28(GND) IC18.41(GND) IC18.44(GND) IC18.67(GND) IC18.70(GND) IC18.73(GND) IC18.77(GND) IC18.83(GND) IC18.86(GND) IC18.88(GND) IC18.89(EP) R44.1
CALIB: R29.1 T1.1(G) ; port CONTROL.CALIB
CLK_N: IC18.39(CLK_N) ; port CLK_N
CLK_P: IC18.38(CLK_P) ; port CLK_P
IN0: IC18.3(Input_0) ; port INPUTS.IN0
IN1: IC18.4(Input_1) ; port INPUTS.IN1
IN2: IC18.7(Input_2) ; port INPUTS.IN2
IN3: IC18.8(Input_3) ; port INPUTS.IN3
IN4: IC18.10(Input_4) ; port INPUTS.IN4
IN5: IC18.11(Input_5) ; port INPUTS.IN5
IN6: IC18.14(Input_6) ; port INPUTS.IN6
IN7: IC18.15(Input_7) ; port INPUTS.IN7
SCL: IC2.6(SCL2) R35.1 ; port CONTROL.SCL
SDA: IC2.5(SDA2) R34.1 ; port CONTROL.SDA
TDC: IC1.7(OUT1) ; port TDC
TDC_N: IC1.1(IN1-) IC18.47(TDCOUT_N) R32.2
TDC_P: IC1.2(IN1+) IC18.48(TDCOUT_P) R32.1
TIME: IC1.6(OUT2) ; port TIME
TIME_N: IC1.4(IN2-) IC18.45(TIME_N) R33.2
TIME_P: IC1.3(IN2+) IC18.46(TIME_P) R33.1
TRGI: IC18.76(TRG_IN) ; port TRGI
TRGO: IC18.35(TRG_OUT) ; port TRGO
VMON: C22.2 R42.2 ; port CONTROL.VMON
NetC7_2: C7.2 R30.2 R31.1
NetC9_1: C9.1 IC2.7(VREF2) IC2.8(EN) R36.1
NetC23_2: C23.2 IC3.3(IN+) R43.2
NetC69_1: C69.1 IC18.19(VBG)
NetC80_1: C80.1 C81.1 C82.1 IC18.40(XVDD) IC18.42(XVDD) L1.1
NetIC2_3: IC2.3(SCL1) IC18.80(SCL) R39.1
NetIC2_4: IC2.4(SDA1) IC18.81(SDA) R40.1
NetIC3_1: IC3.1(OUT) R41.1 R42.1
NetIC3_4: IC3.4(IN-) R41.2 R44.2
NetIC18_17: IC18.17(CAL) R31.2
NetIC18_21: IC18.21(VMON) R43.1
NetIC18_33: IC18.33(SYNC_RST) R27.1 ; port CONTROL.SRST
NetIC18_78: IC18.78(nGRST) IC18.79(nPOR) R28.1 ; port CONTROL.RSTn
NetR30_1: R30.1 T1.3(D)

Not connected (* = marked no-connect by the designer): IC18 30(DBG_FSMI_0)* 31(DBG_FSMI_1)* 32(DBG_FSMI_2)* 34(DBG_FSMO)* 50(OUT_7_N)* 51(OUT_7_P)* 52(OUT_6_N)* 53(OUT_6_P)* 54(OUT_5_N)* 55(OUT_5_P)* 56(OUT_4_N)* 57(OUT_4_P)* 59(OUT_3_N)* 60(OUT_3_P)* 61(OUT_2_N)* 62(OUT_2_P)* 63(OUT_1_N)* 64(OUT_1_P)* 65(OUT_0_N)* 66(OUT_0_P)*

### Channels
FASTIC1: designators end in _FASTIC1; ports CLK_N=SLVS3_N CLK_P=SLVS3_P TDC=NetIC1_FASTIC1_7 TIME=NetIC1_FASTIC1_6 TRGI=NetD1_3 TRGO=NetIC18_FASTIC1_35
FASTIC2: designators end in _FASTIC2; ports CLK_N=SLVS2_N CLK_P=SLVS2_P TDC=NetIC1_FASTIC2_7 TIME=NetIC1_FASTIC2_6 TRGI=NetD6_3 TRGO=NetIC18_FASTIC2_35

### Layout directives
differential pair: TDC_N_FASTIC1, TDC_P_FASTIC1, TIME_N_FASTIC1, TIME_P_FASTIC1

### Notes on the sheet
- Calibration pulse
- Imax ~ 20mA
- ~ 10% Imax
- 200ns - 1us
- Calibration pulse is generated from a digital pulse from the MCU.
- The FastIC needs to be configured to output the VBG to this pin for @{"Id":"RVATNPJO\JXXRLXDP","ObjectType":2} to take effect!
- TIME output is used only for calibrating the internal comparator treshold. When not used, the SLVS driver should be disabled to decrease EMI!
- Boost the 1.2V output to 1.8V (ADC Vref) to maximize ADC reading precision. The voltages monitored are mostly DC biases, so the ~3.4kHz cutoff is more than enough.
- (near R42) The output RC should be placed close to the MCU to get rid of noice induce on the line and to allow for charging the sampling capacitor regardless of the trace inductance.
- AVDD
- The PLL circuitry (XVDD) is expected to produce switching noise only during lock, the treshold circuitry (TVDD) on the other hand is expected to have mostly DC consumption. The TVDD and XVDD are thus supplied from the same LDO, yet the XVDD is still isolated by a ferrite to reduce the chance of noise being induced into the treshold circuitry.
- DVDD + DVDDIO
- OVDD & CVDD
- Project/Equipment
- Document
- File
- Designer
- Drawn by
- Check.by
- Last Mod.
- Print Date
- Sheet
- Size
- A2
- of
- Rev

### Library data of the parts
C7 = CC0402_470PF_50V_10%_X7R: Non-polarised capacitor; Part Description: SMD Multilayer Chip Ceramic Capacitor; Manufacturer: GENERIC; Manufacturer1 Part Number: 223858715618; Voltage: 50V; TC: X7R; Tolerance: ±10%; Part Number: CC0402_470PF_50V_10%_X7R; Component Kind: Standard; Component Type: Standard; Pin Count: 2; Value: 470pF; Status: Not Recommended; Manufacturer Part Number: CC0402_470PF_50V_10%_X7R; Case: 0402; Mounted: Yes; Socket: No; SMD: Yes; Sense: No; Manufacturer1 Example: PHYCOMP; Manufacturer1 ComponentHeight: 0.55mm; HelpURL: \\cern.ch\dfs\Applications\Altium\Datasheets\CC0402_NP0_PHYCOMP.pdf; Author: CERN DEM JLC; CreateDate: 12/3/2007; LatestRevisionDate: 12/3/2007
C8-C11 C51-C58 C61-C66 C70-C73 C77 C78 C80 C81 C83 C84 = CC0402_100NF_16V_10%_X7R: as C1 on sheet top; Part Number: CC0402_100NF_16V_10%_X7R; Component Kind: Standard; Component Type: Standard; Pin Count: 2; Value: 100nF; Status: Not Recommended; Manufacturer Part Number: CC0402_100NF_16V_10%_X7R; Case: 0402; Mounted: Yes; Socket: No; SMD: Yes; Sense: No; HelpURL: \\cern.ch\dfs\Applications\Altium\Datasheets\CC0402_X7R_MURATA_GRM.pdf; Author: CERN DEM JLC; CreateDate: 12/5/2013; LatestRevisionDate: 12/3/2007; Manufacturer1 Example: MURATA; Manufacturer1 ComponentHeight: 0.55mm
C22 C23 C69 C147 C148 = CC0402_10NF_50V_10%_X7R: Non-polarised capacitor; Part Description: SMD Multilayer Chip Ceramic Capacitor; Manufacturer: GENERIC; Manufacturer1 Part Number: GRM155R71H103KA88D; Voltage: 50V; TC: X7R; Tolerance: ±10%; Part Number: CC0402_10NF_50V_10%_X7R; Component Kind: Standard; Component Type: Standard; Pin Count: 2; Value: 10nF; Status: None; Manufacturer Part Number: CC0402_10NF_50V_10%_X7R; Case: 0402; Mounted: Yes; Socket: No; SMD: Yes; Sense: No; Manufacturer1 Example: MURATA; Manufacturer1 ComponentHeight: 0.55mm; HelpURL: \\cern.ch\dfs\Applications\Altium\Datasheets\CC0402_X7R_MURATA_GRM.pdf; Author: CERN DEM MR; CreateDate: 1/8/2016; LatestRevisionDate: 1/8/2016
C47 C59 C60 C67 C68 C74 C79 C82 C85 = CC0603_4.7UF_6.3V_10%_X5R: Non-polarised capacitor; Part Description: SMD Multilayer Chip Ceramic Capacitor; Manufacturer: GENERIC; Manufacturer1 Part Number: 225520613672; Voltage: 6.3V; TC: X5R; Tolerance: ±10%; Part Number: CC0603_4.7UF_6.3V_10%_X5R; Component Kind: Standard; Component Type: Standard; Pin Count: 2; Value: 4.7uF; Status: Preferred; Manufacturer Part Number: CC0603_4.7UF_6.3V_10%_X5R; Case: 0603; Mounted: Yes; Socket: No; SMD: Yes; Sense: No; Manufacturer1 Example: PHYCOMP; Manufacturer1 ComponentHeight: 0.87mm; HelpURL: \\cern.ch\dfs\Applications\Altium\Datasheets\CC0805_X5R_PHYCOMP_HC.pdf; Author: CERN DEM JLC; CreateDate: 12/3/2007; LatestRevisionDate: 12/3/2007
IC3 = AD8541AKSZ-R2: Operational Amplifier; Part Description: CMOS Rail-to-Rail General-Purpose Amplifier; Manufacturer: ANALOG DEVICES; PressFit: No; Bonding: No; Part Number: AD8541AKSZ-R2; Component Kind: Standard; Component Type: Standard; Device: AD8541AKSZ-R2; PackageDescription: SOT353, SC70-5, SOT, 0.65mm Pitch; 5 Pin, 1.25mm W X 2.00mm L X 1.10mm H body, IPC Medium Density; Manufacturer Part Number: AD8541AKS; Pin Count: 5; Case: SOT353; Mounted: Yes; Socket: No; SMD: Yes; Sense: No; ComponentHeight: 1.1mm; Author: CERN DEM JLC; HelpURL: \\cern.ch\dfs\Applications\Altium\Datasheets\AD8541AKSZ-R2.pdf; CreateDate: 4/25/2012; LatestRevisionDate: 3/29/2022
IC18 = FastIC+: Part Description: FastIC+ ASIC. Fast Integrated Circuit for  Readout of High-Performance Detectors with Embedded TDC; Manufacturer: CERN; PressFit: No; Bonding: No; Part Number: FastIC+; Component Kind: Standard; Component Type: Standard; Device: FastIC+; PackageDescription: QFN, 0.40mm Pitch, Square; 89 Pin, 10.00mm L X 10.00mm W X 0.85mm H body (w/Thermal Tab 7.6 X 7.60mm), IPC Medium Density; Manufacturer Part Number: FastIC+; Pin Count: 89; Case: QFN89; Mounted: Yes; Socket: No; SMD: Yes; Sense: No; ComponentHeight: 0.85mm; Author: CERN DEM HF; HelpURL: \\cern.ch\dfs\Applications\Altium\Datasheets\FastIC+.pdf; ComponentLink1URL: \\cern.ch\dfs\Applications\Altium\Datasheets\FastIC+_Package.pdf; ComponentLink1Description: Package Drawing; CreateDate: 12/14/2023; LatestRevisionDate: 12/14/2023
L1 = IND0402_MURATA_BLM15HB221SN1: Part Description: SMD EMIFIL Suppression Chip Ferrite Bead; Manufacturer: MURATA; Power: 250mA; Resistance: 1R; Tolerance: ±25%; Part Number: IND0402_MURATA_BLM15HB221SN1; Component Kind: Standard; Component Type: Standard; Pin Count: 2; Value: 220R@100MHz; Manufacturer Part Number: BLM15HB221SN1; Case: 0402; Mounted: Yes; Socket: No; SMD: Yes; Sense: No; ComponentHeight: 0.55mm; HelpURL: \\cern.ch\dfs\Applications\Altium\Datasheets\IND0402_MURATA_BLM15H.pdf; Author: CERN DEM JLC; CreateDate: 6/23/2009; LatestRevisionDate: 10/25/2018
R27-R29 = R0402_10K_1%_0.0625W_100PPM: Resistor - 1%; Part Description: General Purpose Thick Film Chip Resistor; Manufacturer: GENERIC; Manufacturer1 Part Number: 232270671003L; TC: ±100ppm/°C; PressFit: No; Part Number: R0402_10K_1%_0.0625W_100PPM; Component Kind: Standard; Component Type: Standard; Pin Count: 2; Value: 10k; Status: Not Recommended; Power: 0.0625W; Manufacturer Part Number: R0402_10K_1%_0.0625W_100PPM; Case: 0402; Mounted: Yes; Sense: No; Socket: No; SMD: Yes; Manufacturer1 Example: YAGEO PHYCOMP; Manufacturer1 ComponentHeight: 0.4mm; HelpURL: \\cern.ch\dfs\Applications\Altium\Datasheets\R0402_Phycomp_RC0402.pdf; Author: CERN DEM JLC; CreateDate: 12/3/2007; LatestRevisionDate: 10/17/2012
R30 = R0402_22R_1%_0.0625W_100PPM: as R7 on sheet top; Part Number: R0402_22R_1%_0.0625W_100PPM; Component Kind: Standard; Component Type: Standard; Pin Count: 2; Value: 22; Status: Not Recommended; Power: 0.0625W; Manufacturer Part Number: R0402_22R_1%_0.0625W_100PPM; Case: 0402; Mounted: Yes; Sense: No; Socket: No; SMD: Yes; Manufacturer1 Example: YAGEO PHYCOMP; Manufacturer1 ComponentHeight: 0.4mm; HelpURL: \\cern.ch\dfs\Applications\Altium\Datasheets\R0402_Phycomp_RC0402.pdf; Author: CERN DEM JLC; CreateDate: 12/3/2007; LatestRevisionDate: 10/17/2012
R31 = R0402_220R_1%_0.0625W_100PPM: as R1 on sheet top; Part Number: R0402_220R_1%_0.0625W_100PPM; Component Kind: Standard; Component Type: Standard; Pin Count: 2; Value: 220; Status: Not Recommended; Power: 0.0625W; Manufacturer Part Number: R0402_220R_1%_0.0625W_100PPM; Case: 0402; Mounted: Yes; Sense: No; Socket: No; SMD: Yes; Manufacturer1 Example: YAGEO PHYCOMP; Manufacturer1 ComponentHeight: 0.4mm; HelpURL: \\cern.ch\dfs\Applications\Altium\Datasheets\R0402_Phycomp_RC0402.pdf; Author: CERN DEM JLC; CreateDate: 12/3/2007; LatestRevisionDate: 10/17/2012
R32 R33 = R0402_100R_1%_0.1W_100PPM: as R101 on sheet top; Part Number: R0402_100R_1%_0.1W_100PPM; Component Kind: Standard; Component Type: Standard; Pin Count: 2; Value: 100; Status: Not Recommended; Tolerance: ±1%; Case: 0402; Mounted: Yes; Sense: No; Socket: No; SMD: Yes; Manufacturer1 Example: PANASONIC; Manufacturer1 ComponentHeight: 0.4mm; HelpURL: \\cern.ch\dfs\Applications\Altium\Datasheets\R0402_PANASONIC_ERJ2RK.pdf; Author: CERN DEM JLC; CreateDate: 12/12/2013; LatestRevisionDate: 3/3/2015
R34 R35 R39 R40 R42 R43 = R0402_4K7_1%_0.0625W_100PPM: Resistor - 1%; Part Description: General Purpose Thick Film Chip Resistor; Manufacturer: GENERIC; Manufacturer1 Part Number: 232270674702L; TC: ±100ppm/°C; PressFit: No; Part Number: R0402_4K7_1%_0.0625W_100PPM; Component Kind: Standard; Component Type: Standard; Pin Count: 2; Value: 4k7; Status: Not Recommended; Power: 0.0625W; Manufacturer Part Number: R0402_4K7_1%_0.0625W_100PPM; Case: 0402; Mounted: Yes; Sense: No; Socket: No; SMD: Yes; Manufacturer1 Example: YAGEO PHYCOMP; Manufacturer1 ComponentHeight: 0.4mm; HelpURL: \\cern.ch\dfs\Applications\Altium\Datasheets\R0402_Phycomp_RC0402.pdf; Author: CERN DEM JLC; CreateDate: 12/3/2007; LatestRevisionDate: 10/17/2012
R36 = R0402_200K_1%_0.0625W_100PPM: Resistor - 1%; Part Description: General Purpose Thick Film Chip Resistor; Manufacturer: GENERIC; Manufacturer1 Part Number: 232270672004L; TC: ±100ppm/°C; PressFit: No; Part Number: R0402_200K_1%_0.0625W_100PPM; Component Kind: Standard; Component Type: Standard; Pin Count: 2; Value: 200k; Status: Not Recommended; Power: 0.0625W; Manufacturer Part Number: R0402_200K_1%_0.0625W_100PPM; Case: 0402; Mounted: Yes; Sense: No; Socket: No; SMD: Yes; Manufacturer1 Example: YAGEO PHYCOMP; Manufacturer1 ComponentHeight: 0.4mm; HelpURL: \\cern.ch\dfs\Applications\Altium\Datasheets\R0402_Phycomp_RC0402.pdf; Author: CERN DEM JLC; CreateDate: 12/3/2007; LatestRevisionDate: 10/17/2012
R41 = R0402_10K_0.1%_0.063W_25PPM: Resistor - 0.1%; Part Description: Thin Film Precision Resistor; Manufacturer: GENERIC; Manufacturer1 Part Number: CPF0402B10KE1; Power: 0.063W; TC: ±25ppm/°C; PressFit: No; Part Number: R0402_10K_0.1%_0.063W_25PPM; Component Kind: Standard; Component Type: Standard; Pin Count: 2; Value: 10k; Status: Not Recommended; Manufacturer Part Number: R0402_10K_0.1%_0.063W_25PPM; Case: 0402; Mounted: Yes; Sense: No; Socket: No; SMD: Yes; Manufacturer1 Example: TE CONNECTIVITY; Manufacturer1 ComponentHeight: 0.35mm; HelpURL: \\cern.ch\dfs\Applications\Altium\Datasheets\R0402_TYCO_CPF.pdf; Author: CERN DEM JMW; CreateDate: 9/22/2015; LatestRevisionDate: 9/22/2015
R44 = R0402_20K_0.1%_0.063W_25PPM: Resistor - 0.1%; Part Description: Thin Film Precision Resistor; Manufacturer: GENERIC; Manufacturer1 Part Number: ERA2AEB203X; Power: 0.063W; TC: ±25ppm/°C; Voltage: 50V; PressFit: No; Part Number: R0402_20K_0.1%_0.063W_25PPM; Component Kind: Standard; Component Type: Standard; Pin Count: 2; Value: 20k; Status: Not Recommended; Manufacturer Part Number: R0402_20K_0.1%_0.063W_25PPM; Case: 0402; Mounted: Yes; Sense: No; Socket: No; SMD: Yes; Manufacturer1 Example: PANASONIC; Manufacturer1 ComponentHeight: 0.4mm; HelpURL: \\cern.ch\dfs\Applications\Altium\Datasheets\R0402_PANASONIC_ERA.pdf; Author: CERN DEM BC; CreateDate: 7/10/2020; LatestRevisionDate: 7/10/2020
T1 = IRLML6402PBF: P-CHANNEL MOSFET WITH ZENER DIODE; Part Description: -20V -3.7A P-Channel HEXFET® Power MOSFET; Manufacturer: INTERNATIONAL RECTIFIER; PressFit: No; Bonding: No; Part Number: IRLML6402PBF; Component Kind: Standard; Component Type: Standard; Device: IRLML6402PBF; PackageDescription: SOT23, 0.95mm Pitch; 3 Pin, 1.30mm W X 2.92mm L X 1.12mm H body, IPC Medium Density; Manufacturer Part Number: IRLML6402; Pin Count: 3; Case: SOT23-3; Mounted: Yes; Socket: No; SMD: Yes; Sense: No; ComponentHeight: 1.12mm; HelpURL: \\cern.ch\dfs\Applications\Altium\Datasheets\IRLML6402PBF.pdf; Author: CERN DEM JLC; CreateDate: 8/29/2011; LatestRevisionDate: 8/29/2011